# Altium schematic sheet 7.1 VA_CP.SchDoc: 6.6kW Daul OBC +11kW WPT
size A2; Revision: V 1.0; SheetNumber: 7; SheetTotal: 14; ImagePath: 0
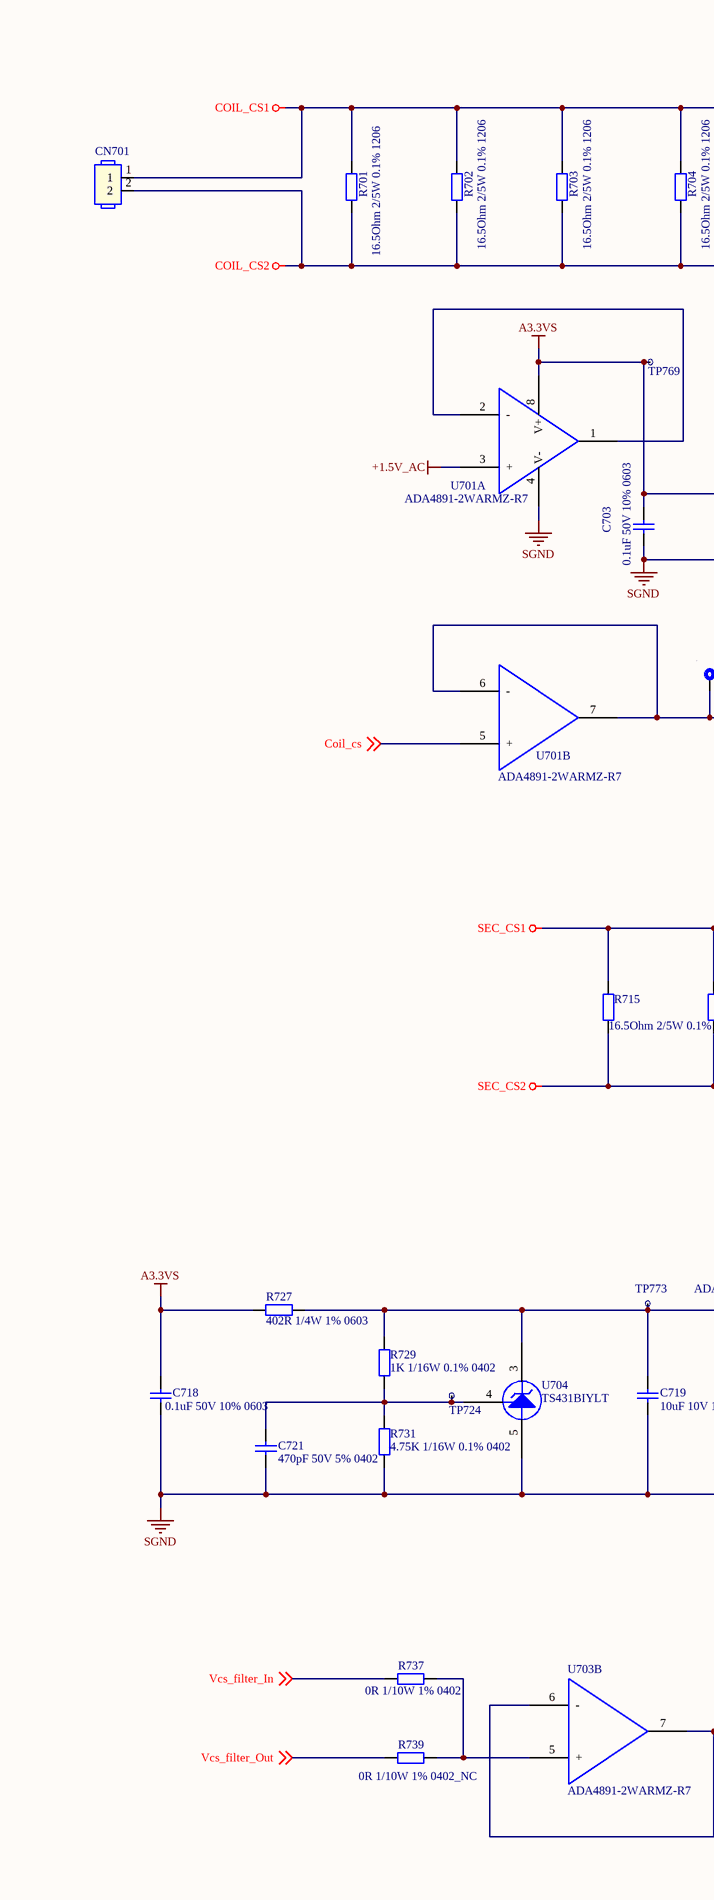
[diagram p0: 7.1 VA_CP.SchDoc, left]
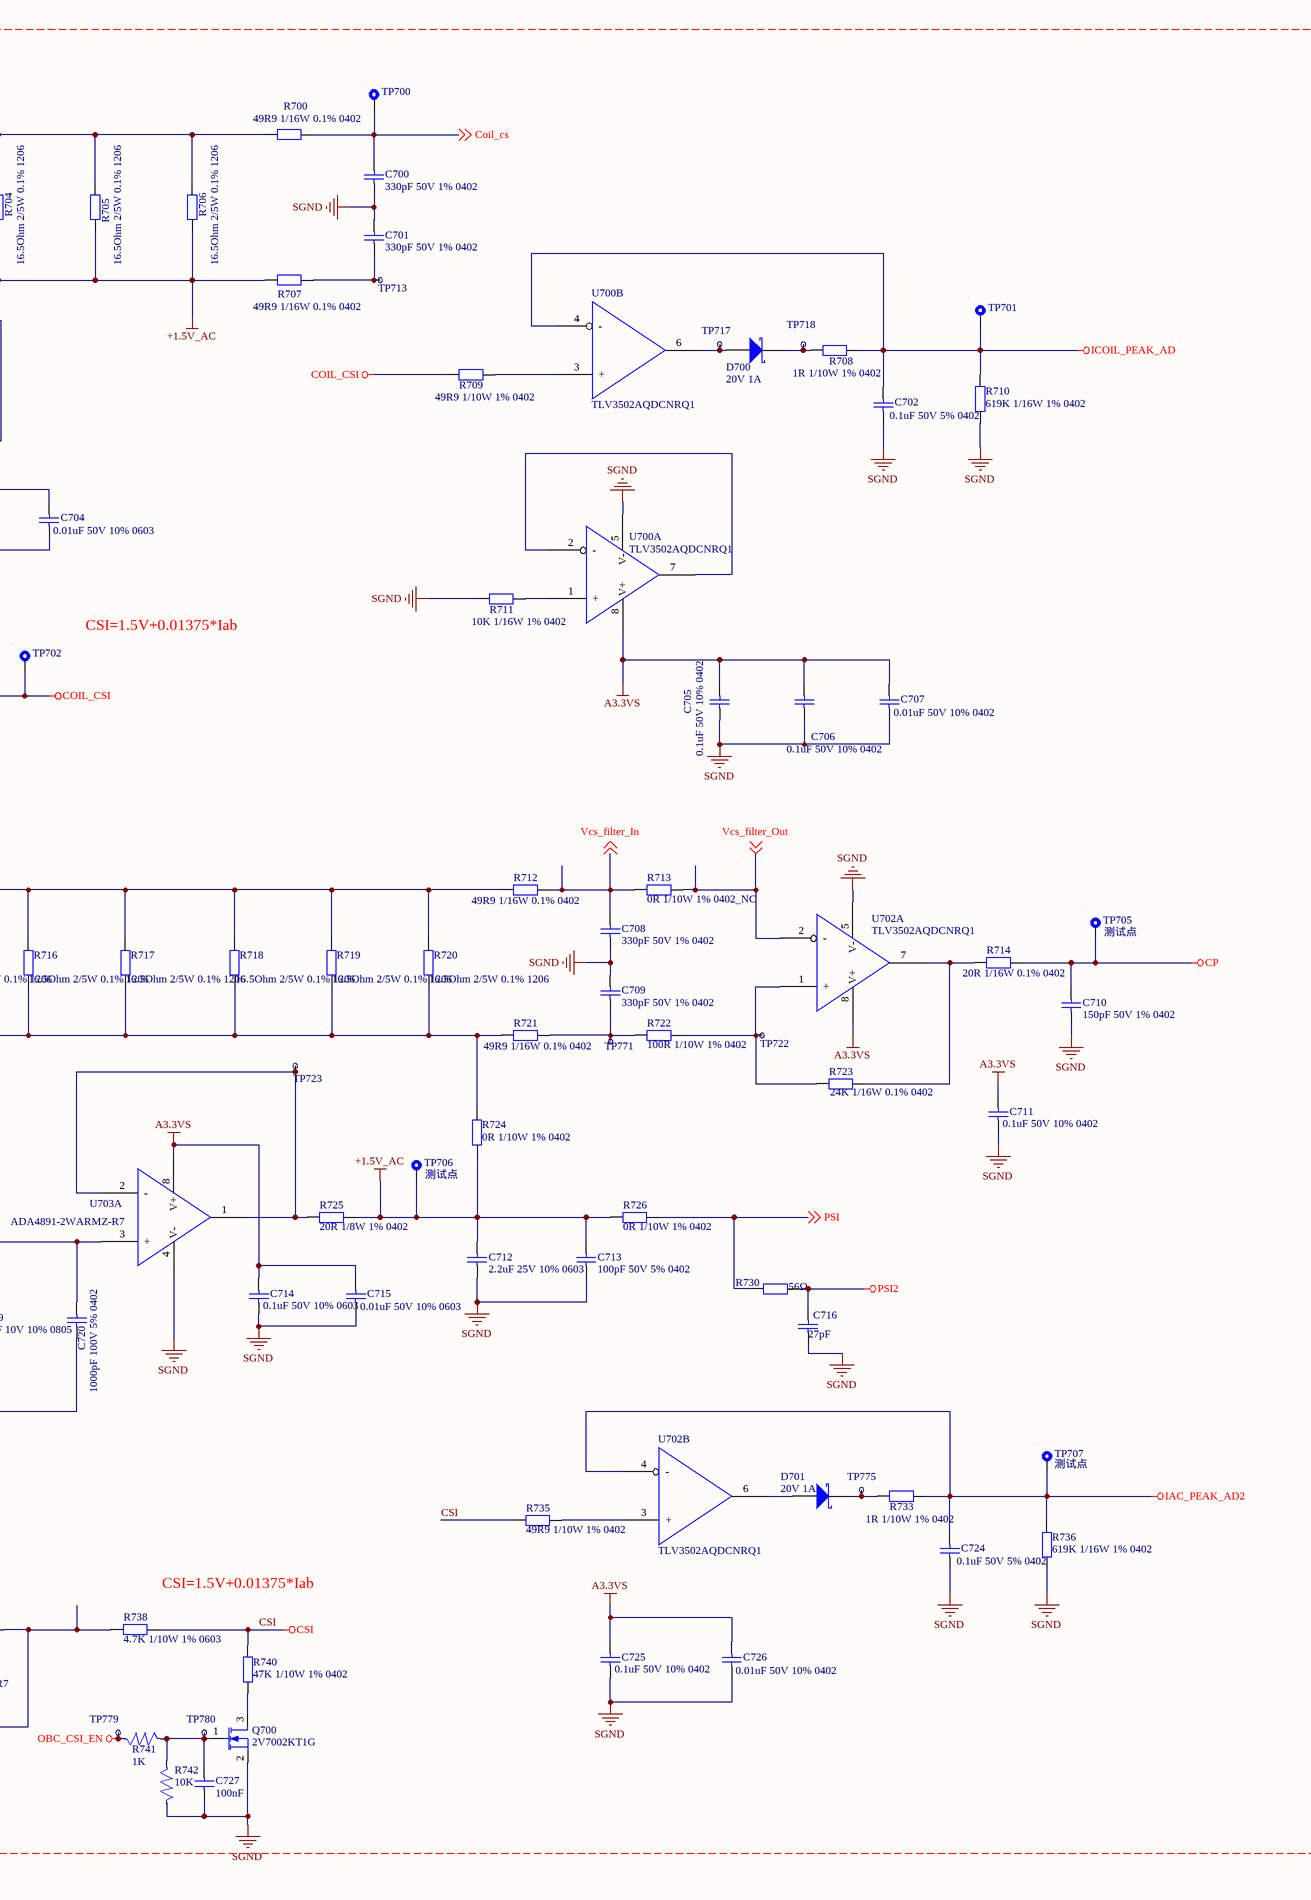
[diagram p1: 7.1 VA_CP.SchDoc, right]

## Parts
C700  330pF 50V 1% 0402  [C0402]
C701  330pF 50V 1% 0402  [C0402]
C702  0.1uF 50V 5% 0402  [C0402]
C703  0.1uF 50V 10% 0603  [C0603]
C704  0.01uF 50V 10% 0603  [C0603]
C705  0.1uF 50V 10% 0402  [C0402]
C706  0.1uF 50V 10% 0402  [C0402]
C707  0.01uF 50V 10% 0402  [C0402]
C708  330pF 50V 1% 0402  [C0402]
C709  330pF 50V 1% 0402  [C0402]
C710  150pF 50V 1% 0402  [C0402]
C711  0.1uF 50V 10% 0402  [C0402]
C712  2.2uF 25V 10% 0603  [C0603]
C713  100pF 50V 5% 0402  [C0402]
C714  0.1uF 50V 10% 0603  [C0402]
C715  0.01uF 50V 10% 0603  [C0402]
C716  值: 27pF  [C0402]  (hidden comment: 27pF 50V±5% C0G  0402)
C718  0.1uF 50V 10% 0603  [C0603]
C719  10uF 10V 10% 0805  [C0805]
C720  1000pF 100V 5% 0402  [C0402]
C721  470pF 50V 5% 0402  [C0402]
C724  0.1uF 50V 5% 0402  [C0402]
C725  0.1uF 50V 10% 0402  [C0402]
C726  0.01uF 50V 10% 0402  [C0402]
C727  100nF  [C0402]
CN701  (no value)  [HY_2MM_1*2P_90MOLEX01]
D700  20V 1A  [SOD-882D]
D701  20V 1A  [SOD-882D]
Q700  2V7002KT1G  [Q_SOT23 - 2]
R700  49R9 1/16W 0.1% 0402  [R0402]
R701  16.5Ohm 2/5W 0.1% 1206  [R1206]
R702  16.5Ohm 2/5W 0.1% 1206  [R1206]
R703  16.5Ohm 2/5W 0.1% 1206  [R1206]
R704  16.5Ohm 2/5W 0.1% 1206  [R1206]
R705  16.5Ohm 2/5W 0.1% 1206  [R1206]
R706  16.5Ohm 2/5W 0.1% 1206  [R1206]
R707  49R9 1/16W 0.1% 0402  [R0402]
R708  1R 1/10W 1% 0402  [R0402]
R709  49R9 1/10W 1% 0402  [R0402]
R710  619K 1/16W 1% 0402  [R0402]
R711  10K 1/16W 1% 0402  [R0402]
R712  49R9 1/16W 0.1% 0402  [R0402]
R713  0R 1/10W 1% 0402_NC  [R0402]
R714  20R 1/16W 0.1% 0402  [R0402]
R715  16.5Ohm 2/5W 0.1% 1206  [R1206]
R716  16.5Ohm 2/5W 0.1% 1206  [R1206]
R717  16.5Ohm 2/5W 0.1% 1206  [R1206]
R718  16.5Ohm 2/5W 0.1% 1206  [R1206]
R719  16.5Ohm 2/5W 0.1% 1206  [R1206]
R720  16.5Ohm 2/5W 0.1% 1206  [R1206]
R721  49R9 1/16W 0.1% 0402  [R0402]
R722  100R 1/10W 1% 0402  [R0402]
R723  24K 1/16W 0.1% 0402  [R0402]
R724  0R 1/10W 1% 0402  [R0402]
R725  20R 1/8W 1% 0402  [R0402]
R726  0R 1/10W 1% 0402  [R0402]
R727  402R 1/4W 1% 0603  [R0603]
R729  1K 1/16W 0.1% 0402  [R0402]
R730  值: 56Ω  [R0402]  (hidden comment: 56Ω ±1% 1/16W 0402)
R731  4.75K 1/16W 0.1% 0402  [R0402]
R733  1R 1/10W 1% 0402  [R0402]
R735  49R9 1/10W 1% 0402  [R0402]
R736  619K 1/16W 1% 0402  [R0402]
R737  0R 1/10W 1% 0402  [R0402]
R738  4.7K 1/10W 1% 0603  [R0402]
R739  0R 1/10W 1% 0402_NC  [R0402]
R740  47K 1/10W 1% 0402  [R0402]
R741  1K  [R0402]
R742  10K  [R0402]
TP700  测试点  [测试点]  (value not drawn)
TP701  测试点  [测试点]  (value not drawn)
TP702  测试点  [测试点]  (value not drawn)
TP705  测试点  [测试点]
TP706  测试点  [测试点]
TP707  测试点  [测试点]
TP713  测试点  [测试点]  (value not drawn)
TP717  测试点  [测试点]  (value not drawn)
TP718  测试点  [测试点]  (value not drawn)
TP722  测试点  [测试点]  (value not drawn)
TP723  测试点  [测试点]  (value not drawn)
TP724  测试点  [测试点]  (value not drawn)
TP769  测试点  [测试点]  (value not drawn)
TP771  测试点  [测试点]  (value not drawn)
TP773  测试点  [测试点]  (value not drawn)
TP775  测试点  [测试点]  (value not drawn)
TP779  测试点  [测试点]  (value not drawn)
TP780  测试点  [测试点]  (value not drawn)
U700  TLV3502AQDCNRQ1  [SON-8]  (parts A,B of 2)
U701  ADA4891-2WARMZ-R7  [SOIC_8]  (parts A,B of 2)
U702  TLV3502AQDCNRQ1  [SON-8]  (parts A,B of 2)
U703  ADA4891-2WARMZ-R7  [SOIC_8]  (parts A,B of 2)
U704  TS431BIYLT  [SOT23-5]

## Nets
+1.5V_AC: C712.2 C713.2 CN701.2 R701.1 R702.1 R703.1 R704.1 R705.1 R706.1 R707.2 R724.2 R725.1 R726.2 TP706.1 U701.3(+)  [also labelled COIL_CS2]
A3.3VS: C703.1 C704.1 C705.1 C706.1 C707.1 C711.1 C714.1 C715.1 C718.1 C725.1 C726.1 R727.2 TP769.1 U700.8(V+) U701.8(V+) U702.8(V+) U703.8(V+)
COIL_CS1: CN701.1 R700.2 R701.2 R702.2 R703.2 R704.2 R705.2 R706.2
COIL_CSI: R709.2 TP702.1 U701.6(-) U701.7
CP: C710.2 R714.1 TP705.1
CSI: R735.2 R738.1 R740.1
IAC_PEAK_AD2: C724.2 R733.1 R736.1 TP707.1 U702.4(-)
ICOIL_PEAK_AD: C702.2 R708.1 R710.1 TP701.1 U700.4(-)
OBC_CSI_EN: R741.2 TP779.1
PSI2: C716.1 R730.2
SEC_CS1: R712.2 R715.2 R716.2 R717.2 R718.2 R719.2 R720.2
SEC_CS2: R715.1 R716.1 R717.1 R718.1 R719.1 R720.1 R721.2 R724.1
SGND: C700.1 C701.2 C702.1 C703.2 C704.2 C705.2 C706.2 C707.2 C708.1 C709.2 C710.1 C711.2 C712.1 C713.1 C714.2 C715.2 C716.2 C718.2 C719.1 C720.1 C721.1 C724.1 C725.2 C726.2 C727.2 Q700.2(S) R710.2 R711.2 R731.1 R736.2 R742.2 U700.5(V-) U701.4(V-) U702.5(V-) U703.4(V-) U704.5
Coil_cs: C700.2 R700.1 TP700.1 U701.5(+) ; off-sheet Coil_cs
PSI: R726.1 R730.1 ; off-sheet PSI
Vcs_filter_In: C708.2 R712.1 R713.2 R737.2 ; off-sheet Vcs_filter_In
Vcs_filter_Out: R713.1 R739.2 U702.2(-) ; off-sheet Vcs_filter_Out
NetC701_1: C701.1 R707.1 TP713.1
NetC709_1: C709.1 R721.1 R722.2 TP771.1
NetC719_2: C719.2 C720.2 R727.1 R729.2 TP773.1 U703.3(+) U704.3
NetC721_2: C721.2 R729.1 R731.2 TP724.1 U704.4
NetC727_1: C727.1 Q700.1(G) R741.1 R742.1 TP780.1
NetD700_1: D700.1(A) TP717.1 U700.6
NetD700_2: D700.2(K) R708.2 TP718.1
NetD701_1: D701.1(A) U702.6
NetD701_2: D701.2(K) R733.2 TP775.1
NetQ700_3: Q700.3(D) R740.2
NetR709_1: R709.1 U700.3(+)
NetR711_1: R711.1 U700.1(+)
NetR714_2: R714.2 R723.1 U702.7
NetR722_1: R722.1 R723.2 TP722.1 U702.1(+)
NetR725_2: R725.2 TP723.1 U703.1 U703.2(-)
NetR735_1: R735.1 U702.3(+)
NetR737_1: R737.1 R739.1 U703.5(+)
NetR738_2: R738.2 U703.6(-) U703.7
NetU700_2: U700.2(-) U700.7
NetU701_1: U701.1 U701.2(-)

## Layout directives
net class SEC-50V: +1.5V_AC, A3.3VS, Coil_cs, COIL_CS1, COIL_CS2, COIL_CSI, CP, CSI, IAC_PEAK_AD2, ICOIL_PEAK_AD, OBC_CSI_EN, PSI, PSI2, SEC_CS1, SEC_CS2, SGND, Vcs_filter_In, Vcs_filter_Out

## Notes on the sheet
- CSI=1.5V+0.01375*Iab
- (near R738) CSI=1.5V+0.01375*Iab

## Library data of the parts
C700 C701 C708 C709 = Cap Semi: CAP CER 330pF 50V 1% C0G/NP0 0402 AEC-Q200 SMD; 厂商: Murata; 规格: GCM1555C1H331FA16D
C702 C724 = Cap Semi: CAP CER 0.1uF 100V 5% C0G/NP0 1206 AEC-Q200 SMD; 厂商: Murata; 规格: GCM31C5C2A104JE02L
C703 C705 C706 C711 C714 C718 C725 = Cap Semi: CAP CER 0.1uF 50V 10% X7R 0603 AEC-Q200 SMD; 厂商: SAMSUNG; 规格: CL10B104KB8WPNC
C704 C707 C715 C726 = Cap Semi: CAP CER 0.01uF 50V 10% X7R 0603 AEC-Q200 SMD; 厂商: YAGEO; 规格: AC0603KRX7R9BB103
C710 = Cap Semi: CAP CER 150pF 50V 1% C0G/NP0 AEC-Q200 0402 SMD; 厂商: YAGEO; 规格: AC0402FRNPO9BN151
C712 = Cap Semi: CAP CER 2.2uF 25V 10% X5R 0603 SMD; 厂商: Samsung; 规格: CL10A225KA8NNNC
C713 = Cap Semi: CAP CER 100pF 50V 5% C0G/NP0 0603 SMD; 厂商: SAMSUNG; 规格: CL10C101JB81PNC
C716 = 27pF 50V±5% C0G  0402: 温度范围: -55℃~﹢125℃; 料号: 90-E00C0058; 品名: CAP CER 27pF,±5%,50V,C0G,0402,TAIYO YUDEN#UMK105 CG270JVHF; 厂商: TAIYO YUDEN; 规格: UMK105CG270JVHF(TAIYO YUDEN); 耐压值: 50V; Qualified: AEC-Q200
C719 = Cap Semi: CAP CER 10uF 35V 10% X5R 0805 SMD; 厂商: SAMSUNG; 规格: CL21A106KBYQNNE
C720 = Cap Semi: CAP CER 1000pF 100V 5% X7R 0402 AEC-Q200 SMD; 厂商: Murata; 规格: GCM155R72A102JA37D
C721 = Cap Semi: CAP CER 470pF 50V 5% C0G/NP0 0402 AEC-Q200 SMD; 厂商: Taiyo; 规格: UMK105CG471JVHF
C727 = Cap: Manufacturer: Yageo; Manufacturer P/N: AC0402KRX7R9BB104; DIP/SMD: SMD
CN701 = CN1.25-02P
D700 D701 = D Schottky: DIODE SBD 20V 1A SOD-882D AEC-Q101; 厂商: NXP; 规格: PMEG2010BELD
Q700 = MOSFET_N CHANNEL: Manufacturer: ONSemi; DIP/SMD: SMD; Manufacturer P/N: 2V7002KT1G
R700 R707 R712 R721 = Res2: RES Thin Film 49R9 1/16W 0.1% 0402 AEC-Q200 SMD; 厂商: YAGEO; 规格: AT0402BRD0749R9L
R701-R706 R715-R720 = Res2: RES Thin Film 16.5Ohm 2/5W 0.1% 1206 AEC-Q200 SMD; 厂商: TE; 规格: RQ73C2B16R5BTD
R708 R733 = Res2: RES Thick Film 1R 1/10W 1% 0603 AEC-Q200 SMD; 厂商: TA-I; 规格: RMS06FT1R00
R709 R735 R738 R740 = Res2: RES Thick Film 49R9 1/10W 1% 0603 AEC-Q200 SMD; 厂商: TA-I; 规格: RMS06FT49R9
R710 R736 = Res2: RES Thick Film 619K 1/16W 1% 0402 AEC-Q200 SMD; 厂商: YAGEO; 规格: AC0402FR-07619KL
R711 = Res2: RES Thick Film 10K 1/16W 1% 0402 SMD; 厂商: YAGEO; 规格: AC0402FR-0710KL
R713 = Res2: RES Thick Film 0R 1/10W 1% 0603 SMD; 厂商: *; 规格: *
R714 = Res2: RES Thin Film 20R 1/16W 0.1% 0402 AEC-Q200 SMD; 厂商: YAGEO; 规格: AT0402BRD0720RL
R722 = Res2: RES Thick Film 100R 1/10W 1% 0603 AEC-Q200 SMD; 厂商: TA-I; 规格: RMS06FT1000
R723 = Res2: RES Thin Film 24K 1/16W 0.1% 0402 AEC-Q200 SMD; 厂商: YAGEO; 规格: AT0402BRD0724KL
R724 R726 R737 = Res2: RES Thick Film 0R 1/10W 1% AEC-Q200 0603 SMD; 厂商: TA-I; 规格: RMS06FT0
R725 = Res2: RES Thick Film 20R 1/8W 1% 0805 AEC-Q200 SMD; 厂商: TA-I; 规格: RMS10FT20R0
R727 = Res2: RES Thick Film 402R 1/4W 1% 1206 AEC-Q200 SMD; 厂商: YAGEO; 规格: AC1206FR-07402RL
R729 = Res2: RES Thin Film 1K 1/16W 0.1% 0402 AEC-Q200 SMD; 厂商: YAGEO; 规格: AT0402BRD071KL
R730 = 56Ω ±1% 1/16W 0402: 料号: 90-E00R0101; 规格: RMC1/16SK560FTH (KAMAYA); 品名: RES SMD 56Ω ±1% 1/16W 0402,KAMAYA#RMC1/16SK560FTH; 温度范围: -55℃~+155℃; 厂商: KAMAYA; Qualified: AEC-Q200; 耐压值: 50V
R731 = Res2: RES Thin Film 4.75K 1/16W 0.1% 0402 AEC-Q200 SMD; 厂商: YAGEO; 规格: AT0402BRD074K75L
R739 = Res2: RES Thick Film 0R 1/10W 1% AEC-Q200 0603 SMD
R741 = RESISTOR_1206: Manufacturer: Yageo; Manufacturer P/N: AC0402FR-0710RL; DIP/SMD: SMD
R742 = RESISTOR_1206: Manufacturer: Yageo; Manufacturer P/N: AC0402FR-0710KL; DIP/SMD: SMD
TP700-TP702 TP705-TP707 = Test Point: Test Point 1mm
U700 U702 = TLV3502AQDCNRQ1: IC COMPARATOR 2.7V~5.5V SOT23-8; 厂商: Texas Instruments; 规格: TLV3502AQDCNRQ1
U701 U703 = ADA4891-2WARMZ-R7: IC, High Speed, Rail-to-Rail Amplifiers, 2.7V~5.5V, MSOP-8; 厂商: ADI; 规格: ADA4891-2WARMZ-R7
U704 = TS431BIYLT: IC VREF SHUNT ADJ 1.24V~6V 30mA SOT23-5; 厂商: STMicroelectronics; 规格: TS431BIYLT